# EAGLE schematic SMD_cree_driver_led-mosfet002 (EAGLE 6.2)
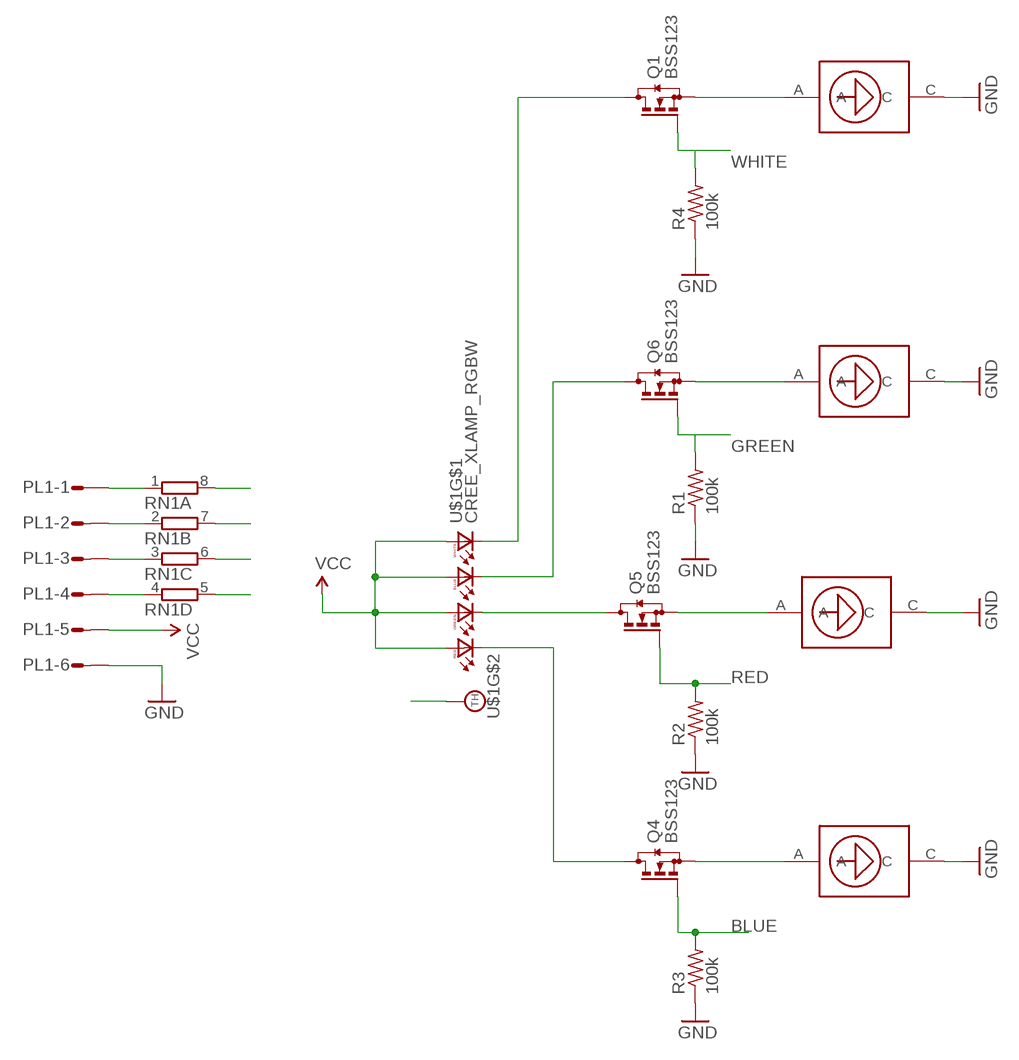
[diagram p0: schematic, sheet 1]

## Parts
PL1  DF3-06R  [DF3R-06]
Q1  BSS123  [SOT23]
Q4  BSS123  [SOT23]
Q5  BSS123  [SOT23]
Q6  BSS123  [SOT23]
R1  100k  R-US_R0402  [R0402]
R2  100k  R-US_R0402  [R0402]
R3  100k  R-US_R0402  [R0402]
R4  100k  R-US_R0402  [R0402]
RN1  4R-N0603-ARC  [0603-ARC]
U$1  CREE_XLAMP_RGBW  [CREE_XLAMP_XML]
U$2  NSI50350AST3G  [SMC-2]
U$3  NSI50350AST3G  [SMC-2]
U$4  NSI50350AST3G  [SMC-2]
U$5  NSI50350AST3G  [SMC-2]

## Nets
BLUE [sig]: Q4.1(G) R3.2 RN1.7
BLUE_OUT [sig]: PL1.4 RN1.4
GND: PL1.6 R1.1 R2.1 R3.1 R4.1 U$2.C U$3.C U$4.C U$5.C
GREEN [sig]: Q6.1(G) R1.2 RN1.6
GREEN_OUT [sig]: PL1.2 RN1.2
N$1: Q6.3(D) U$1.6(BC)
N$2: Q5.3(D) U$1.7(GC)
N$3: Q4.3(D) U$1.8(RC)
N$4: Q6.2(S) U$2.A
N$5: PL1.1 RN1.1
N$6: Q4.2(S) U$4.A
N$7: Q5.2(S) U$3.A
N$12: Q1.2(S) U$5.A
N$13: Q1.3(D) U$1.5(WC)
RED [sig]: Q5.1(G) R2.2 RN1.5
RED_OUT [sig]: PL1.3 RN1.3
THERM: U$1.P$1(TH)
VCC: PL1.5 U$1.1(RA) U$1.2(GA) U$1.3(BA) U$1.4(WA)
WHITE [sig]: Q1.1(G) R4.2 RN1.8

## Library data of the parts
PL1 = con-hirose-df3:DF3-06: Single row connector 2mm 6 way
Q1 Q4-Q6 = transistor-small-signal:BSS123: N-CHANNEL MOS FET
R1-R4 = resistor:R-US_: RESISTOR, American symbol
RN1 = resistor-dil:4R-N: Array Chip Resistor Source: RS Component / Phycomp; OC_FARNELL: unknown; OC_NEWARK: unknown
U$1 = led:CREE_XLAMP_RGBW: Cree XLAMP XM-L Color RGBW led http://www.mouser.com/ds/2/90/XLampXML_Color-218132.pdf
U$2-U$5 = on-semiconductor:NSI50350AST3G

## Net classes
0 default: width 0.813 mm
1 sig: width 0.305 mm